# EasyEDA Pro project PS2toUSB.eprj

# Schematic Schematic1
Create Date: 2024-05-09; Page Name: P1; Project Name: PS2toUSB; Schematic Name: Schematic1; Update Date: 2024-05-14; Company: 嘉立创EDA; Page Size: A4; Version: V1.0
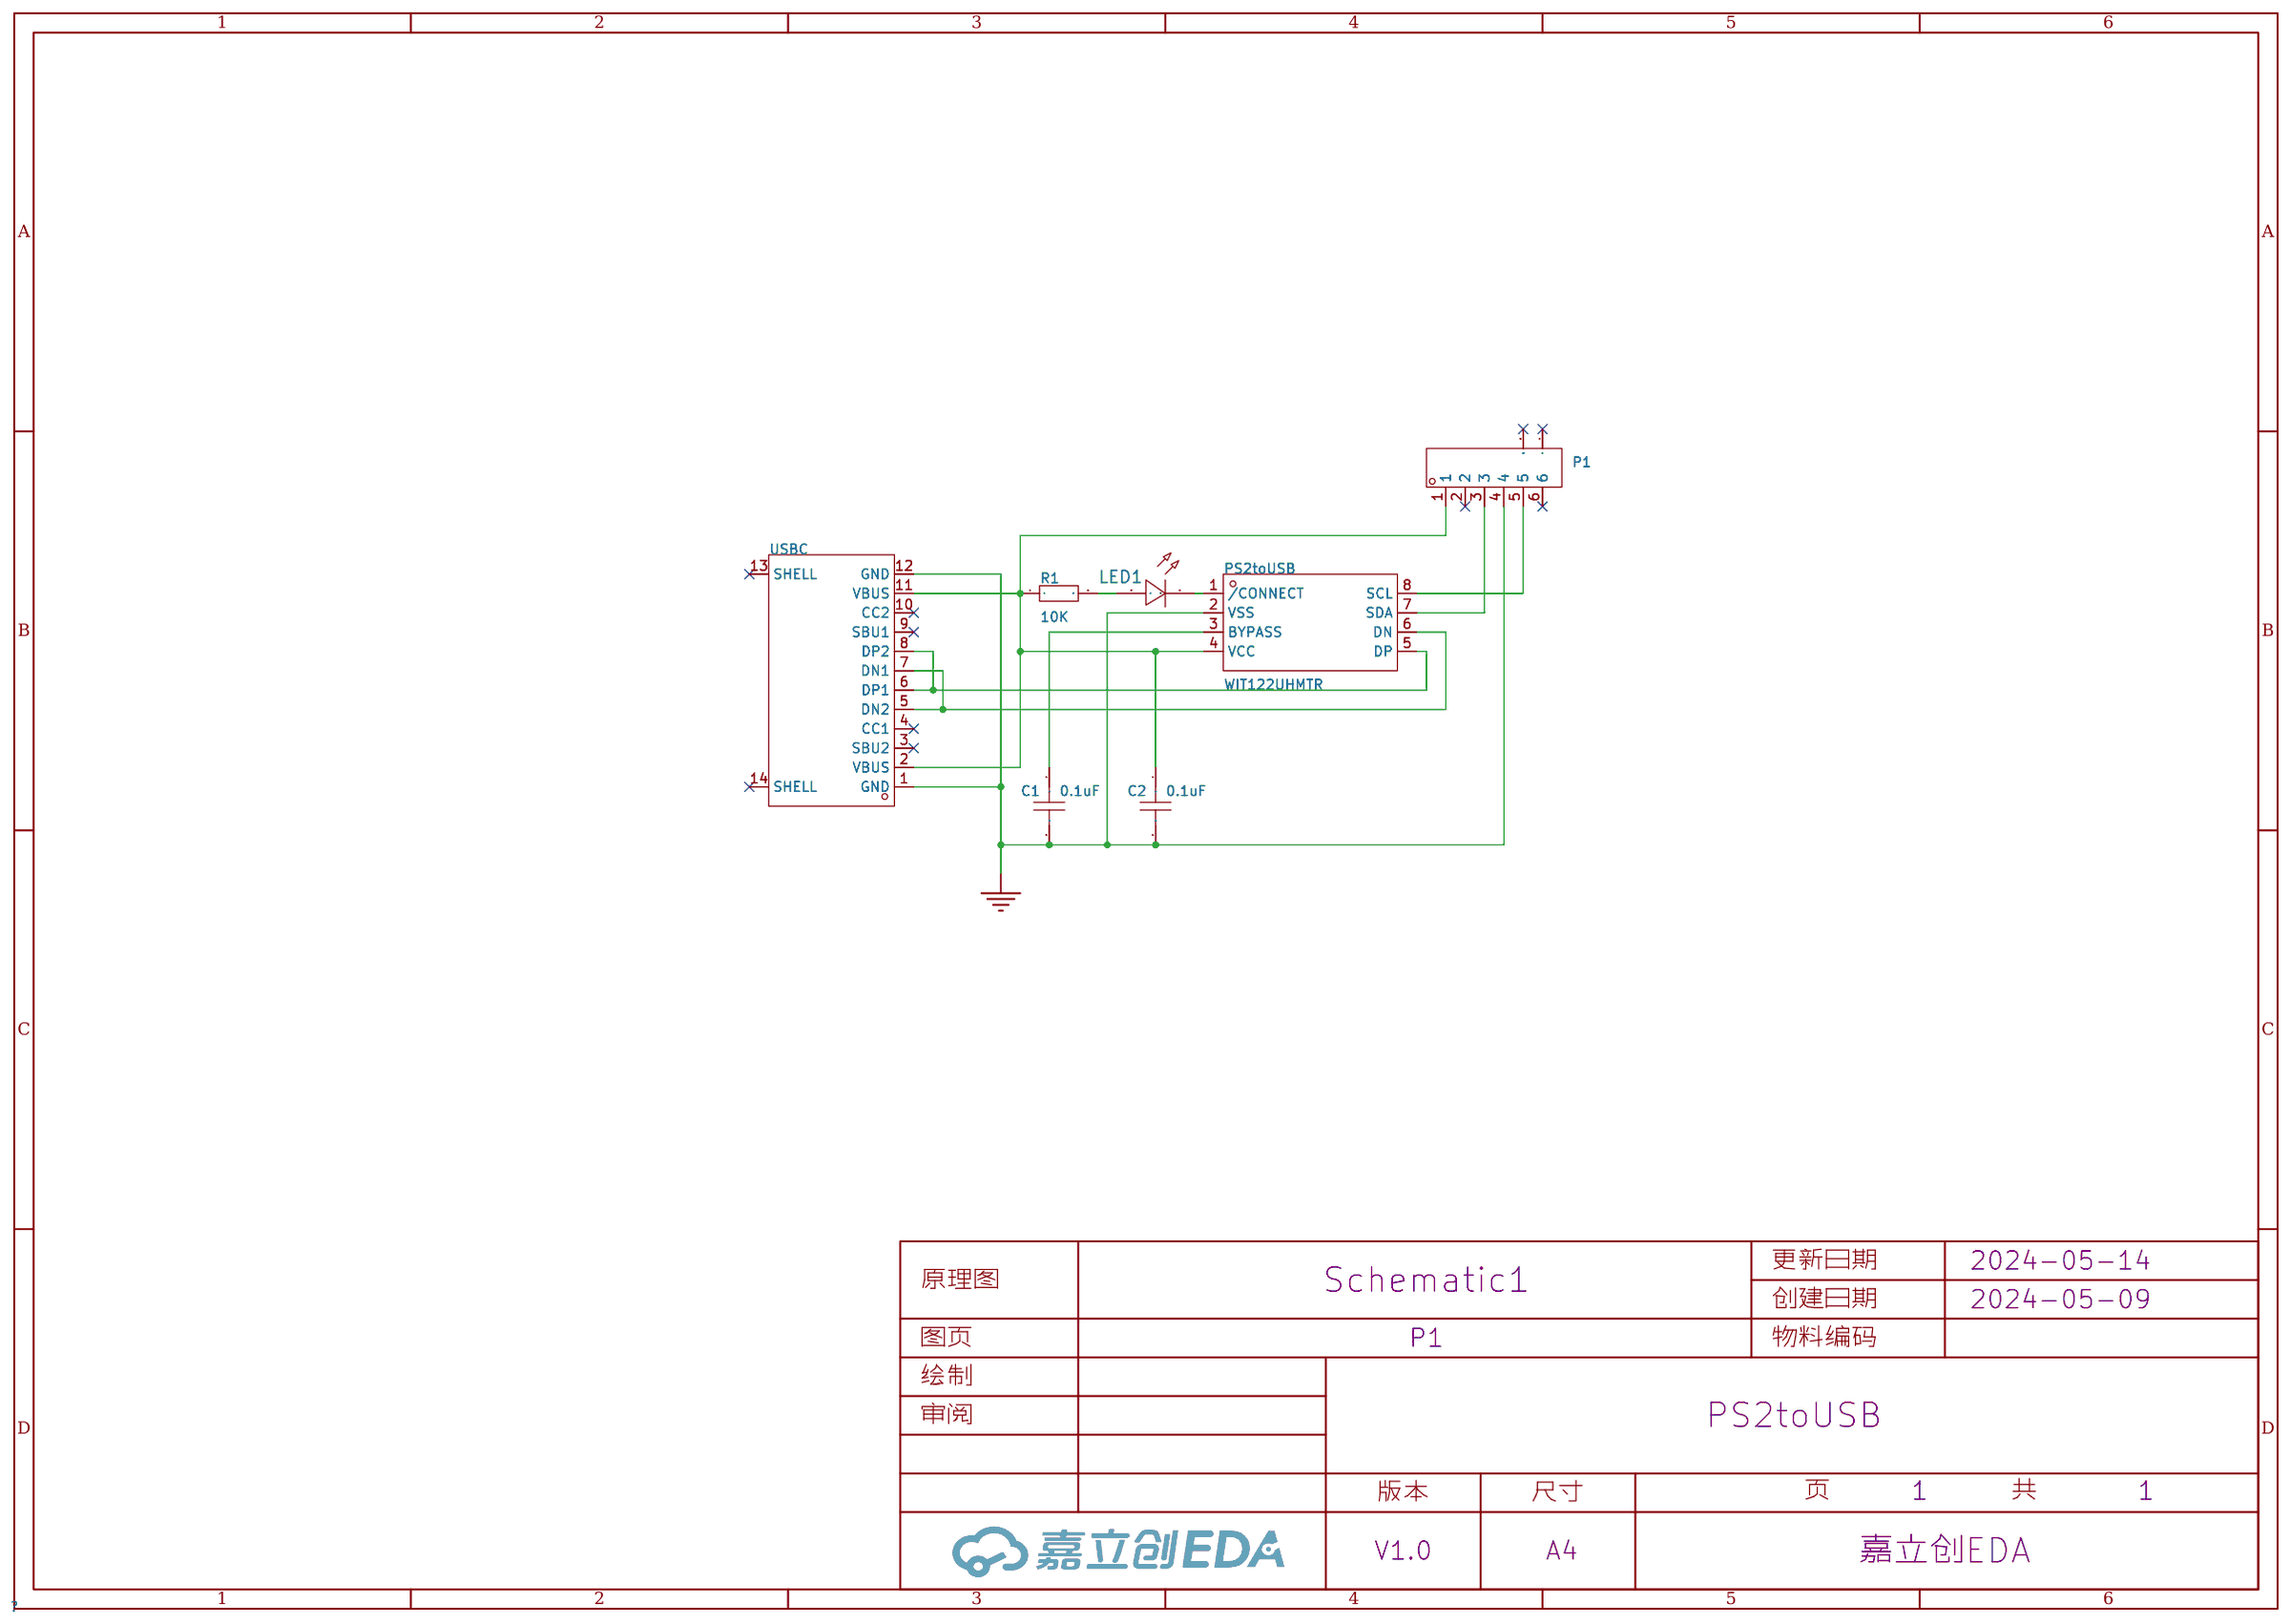
[diagram p0: schematic sheet]

## Parts
C1  0.1uF  [C0603]
C2  0.1uF  [C0603]
LED1  -  [LED_0603]
P1  VCC  [FPC-SMD_C47271]
PS2toUSB  WIT122UHMTR  [SOIC-8_L4.9-W3.9-P1.27-LS6.0-TR]
R1  10K  [R0603]
USBC  TYPE-C 16PIN 2MD(073)  [USB-C-SMD_TYPE-C-6PIN-2MD-073]

## Library data of the parts
C1 C2 = CAP_0603: Supplier Footprint: 0603
LED1 = LED_0603-R: Supplier Footprint: 0603
P1 = 1.0-6P上接: 锁定特性:抽屉式;触点类型:上接;触点数量:6P;间距:1mm;安装类型:卧贴;工作温度范围:-25℃~+85℃;; LCSC Part Name: 间距:1mm P数:6P 抽屉式 上接; Supplier Part: C47271; Manufacturer: BOOMELE(博穆精密); Supplier Footprint: SMD,P=1mm,卧贴; Datasheet: https://atta.szlcsc.com/upload/public/pdf/source/20231027/443F616BA0A67C4DA05E58DE2BCDE40A.pdf; Supplier: LCSC; Locking Feature: 抽屉式; Contact Type: 上接; Number of Contacts: 6P; Pitch: 1mm; Mounting Type: 卧贴; FFC, FCB Thickness: 0.3mm; Height Above Board: 2.8mm; Operating Temperature Range: -25℃~+85℃
PS2toUSB = WIT122UHMTR: Supplier Part: C9900004490; Supplier Footprint: SOIC-8; JLCPCB Part Class: 扩展库; Supplier: LCSC
R1 = Res_0603: Supplier Footprint: 0603
USBC = TYPE-C 16PIN 2MD(073): 连接器类型:Type-C;标准:-;公母:母;端口数量:1;触点数量:16P;安装方式:卧贴;额定电流 - 电源:5A;工作温度范围:-25℃~+85℃;; LCSC Part Name: Type-C 母 卧贴; Supplier Part: C2765186; Manufacturer: SHOU HAN(首韩); Supplier Footprint: SMD; Datasheet: https://atta.szlcsc.com/upload/public/pdf/source/20211123/39B17C16241EAC15C5E277BDA434118E.pdf; Supplier: LCSC; Connector Type: Type-C; Gender: 母; Number of Ports: 1; Number of Contacts: 16P; Mounting Style: 卧贴; Current Rating - Power (Max): 5A; Operating Temperature Range: -25℃~+85℃

## Nets
GND: C1.2 C2.2 P1.4 PS2toUSB.2(VSS) USBC.1(GND) USBC.12(GND)
$1N671: C1.1 PS2toUSB.3(BYPASS)
$1N785: LED1.2(A) R1.2
$1N812: LED1.1(C) PS2toUSB.1(/CONNECT)
Net-(C2-1): C2.1 P1.1 PS2toUSB.4(VCC) R1.1 USBC.2(VBUS) USBC.11(VBUS)
Net-(P1-3): P1.3 PS2toUSB.7(SDA)
Net-(P1-5): P1.5 PS2toUSB.8(SCL)
Net-(PS2toUSB-5): PS2toUSB.5(DP) USBC.6(DP1) USBC.8(DP2)
Net-(PS2toUSB-6): PS2toUSB.6(DN) USBC.5(DN2) USBC.7(DN1)

Not connected (* = marked no-connect by the designer): P1 2* 6* 7* 8*; USBC 3(SBU2)* 4(CC1)* 9(SBU1)* 10(CC2)* 13(SHELL)* 14(SHELL)*

# Board PCB1
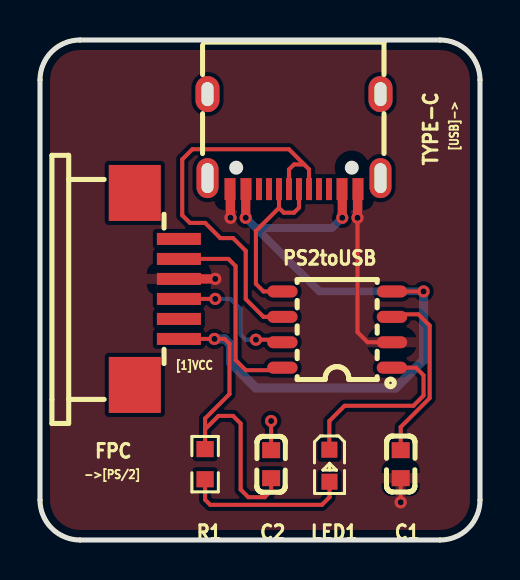
[diagram p1: board, top side]
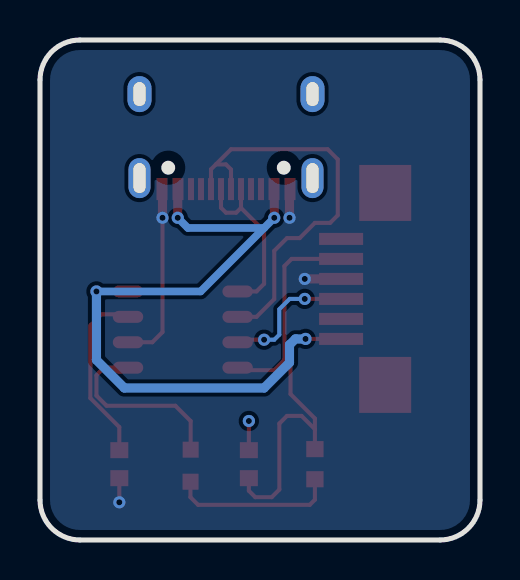
[diagram p2: board, bottom side, seen from below]

Outline 22 x 25 mm; copper layers: Top Layer, Bottom Layer. Coordinates in mm from the lower left corner of the outline.
Outline path: 0,23 0,2 arc(0.59,0.59) 2,0 20,0 arc(21.41,0.59) 22,2 22,23 arc(21.41,24.41) 20,25 2,25 arc(0.59,24.41) 0,23
Stack: Top Layer 0.035mm / Dielectric1 1.51mm FR4 er 4.5 / Bottom Layer 0.035mm

## Design rules (mm)
template: JLCPCB Capability(Two Layers Board)
spacing copperThickness1oz (default): track to track 0.102, other pairs 0.152 to 0.3
spacing copperThickness2oz: track to track 0.203, other pairs 0.152 to 0.3
track width copperThickness1oz (default): min 0.127, default 0.254, max 2.54
track width copperThickness2oz: min 0.203, default 0.254, max 2.54
differential pair differentialPair (default): width min 0.127, default 0.254, max 2.54; gap min 0.152, default 0.152
via viaSize (default): diameter min 0.5, default 0.61, max 10; hole min 0.3, default 0.305, max 6.3

## Placement (name value [footprint] x y rotation side)
C1  0.1uF  [C0603]  18.03 3.79 270 top
C2  0.1uF  [C0603]  11.56 3.79 90 top
FPC  VCC  [FPC-SMD_C47271]  5.84 12.55 270 top
LED1  -  [LED_0603]  14.48 3.66 270 top
PS2toUSB  WIT122UHMTR  [SOIC-8_L4.9-W3.9-P1.27-LS6.0-TR]  14.86 10.52 270 top
R1  10K  [R0603]  8.25 3.79 270 top
TYPE-C  TYPE-C 16PIN 2MD(073)  [USB-C-SMD_TYPE-C-6PIN-2MD-073]  12.7 19.92 180 top

## Footprints (pads in the part's own frame, mm; a bottom-side part is the same pattern mirrored in y, then rotated)
C0603
  rect 0.8x0.9 smd: 1(-0.7,0) 2(0.7,0)
FPC-SMD_C47271
  rect 0.6x2.2 smd: 1(2.5,1.103) 2(1.5,1.103) 3(0.5,1.103) 4(-0.5,1.103) 5(-1.5,1.103) 6(-2.5,1.103)
  rect 2.8x2.6 smd: 7(-4.8,-1.103) 8(4.8,-1.101)
LED_0603
  rect 0.8x0.8 smd: 1(-0.851,-0.01) 2(0.75,-0.005)
R0603
  rect 0.806x0.864 smd: 1(-0.753,0) 2(0.753,0)
SOIC-8_L4.9-W3.9-P1.27-LS6.0-TR
  oval 0.6x1.52 smd: 1(1.905,2.74) 2(0.635,2.74) 3(-0.635,2.74) 4(-1.905,2.74) 5(-1.905,-2.74) 6(-0.635,-2.74) 7(0.635,-2.74) 8(1.905,-2.74)
USB-C-SMD_TYPE-C-6PIN-2MD-073
  rect 0.55x1.1 smd: 1(-3.2,2.375) 2(-2.4,2.375) 11(2.4,2.375) 12(3.2,2.375)
  rect 0.3x1.1 smd: 3(-1.75,2.375) 4(-1.25,2.375) 5(-0.75,2.375) 6(-0.25,2.375) 7(0.25,2.375) 8(0.75,2.375) 9(1.25,2.375) 10(1.75,2.375)
  oval 1.1x2 hole 0.6x1.5: 13(-4.325,1.825) 14(4.325,1.825)
  oval 1.2x1.8 hole 0.6x1.2: 13(-4.325,-2.375) 14(4.325,-2.375)

## Nets
GND: C1.2 FPC.4 PS2toUSB.2 TYPE-C.1 TYPE-C.12
·: C2.2
$1N671: C1.1 PS2toUSB.3
$1N785: LED1.2 R1.2
$1N812: LED1.1 PS2toUSB.1
$1N840: PS2toUSB.6 TYPE-C.5 TYPE-C.7
$1N848: PS2toUSB.5 TYPE-C.6 TYPE-C.8
$1N1105: FPC.3 PS2toUSB.7
$1N1113: FPC.5 PS2toUSB.8
$1N1121: C2.1 FPC.1 PS2toUSB.4 R1.1 TYPE-C.2 TYPE-C.11

Pads without a net: FPC 2 6 7 8; TYPE-C 3 4 9 10 13 14

## Via types
v1: diameter 0.61, hole 0.305, Top Layer to Bottom Layer, 11 vias

## Routing (per net, layer and track width the routed paths; a pad name or vN(x,y) marks a point on that pad's centre or on a via; arc(x,y) is an arc through that point)
GND: length 15
  Top Layer w0.203: v1(15.88,16.11) 15.88,10.39 16.38,9.89 PS2toUSB.2 ; C1.2 v1(18.03,1.89) ; 11.56,4.49 v1(11.56,5.95)
  Top Layer w0.457: v1(9.53,16.11) 9.53,17.52 TYPE-C.12 ; v1(15.88,16.11) 15.88,17.52 TYPE-C.1 ; FPC.4 v1(8.76,13.05)
$1N671: length 9
  Top Layer w0.203: 17.6,11.16 17.73,11.28 18.92,11.28 19.48,10.72 19.48,7.09 18.03,5.65 C1.1
$1N785: length 8.3
  Top Layer w0.203: LED1.2 14.48,2.91 14.48,2.14 14.1,1.76 8.51,1.76 8.25,2.01 R1.2
$1N812: length 9.4
  Top Layer w0.203: LED1.1 14.47,5.95 15.23,6.71 18.67,6.71 19.18,7.22 19.18,8.24 18.8,8.62 PS2toUSB.1
$1N840: length 21.1
  Top Layer w0.203: 13.21,18.78 13.45,18.53 TYPE-C.5 ; 13.21,18.78 12.45,19.54 7.62,19.54 7.11,19.03 7.11,16.24 7.49,15.86 8.25,15.86 9.02,15.09 9.65,15.09 10.29,14.46 10.29,12.05 11.18,11.16 12.12,11.16 ; 13.21,18.78 12.7,18.78 12.45,18.53 TYPE-C.7
$1N848: length 8.8
  Top Layer w0.203: 11.95,16.61 12.19,16.36 12.7,16.36 12.95,16.61 TYPE-C.6 ; 11.95,16.61 10.79,15.45 10.79,12.81 11.18,12.43 PS2toUSB.5 ; 11.95,16.61 TYPE-C.8
$1N1105: length 6.8
  Top Layer w0.203: v1(10.79,10.01) 11.99,10.01 PS2toUSB.7 ; FPC.3 v1(8.76,12.05)
  Bottom Layer w0.203: v1(10.79,10.01) 10.29,10.01 10.03,10.27 10.03,11.54 9.52,12.05 v1(8.76,12.05)
$1N1113: length 10.3
  Top Layer w0.203: PS2toUSB.8 11.99,8.49 10.29,8.49 9.78,9 9.78,13.7 9.42,14.05 FPC.5
$1N1121: length 51.8
  Top Layer w0.203: C2.1 11.56,2.46 11.24,2.14 10.41,2.14 10.03,2.52 10.03,5.82 9.65,6.2 8.92,6.2 8.25,5.54 ; R1.1 8.25,5.54 ; 8.25,5.54 8.25,6.08 9.47,7.3 9.47,9.81 9.23,10.05 v1(8.72,10.05) FPC.1 ; PS2toUSB.4 v1(19.18,12.43)
  Top Layer w0.457: v1(10.29,16.11) 10.29,17.53 TYPE-C.11 ; v1(15.11,16.11) 15.11,17.53 TYPE-C.2
  Bottom Layer w0.381: v1(19.18,12.43) 13.97,12.43 10.79,15.6 ; v1(10.29,16.11) 10.79,15.6 ; 10.79,15.6 14.6,15.6 v1(15.11,16.11)
  Bottom Layer w0.457: v1(19.18,12.43) 19.18,9 17.78,7.6 10.79,7.6 9.53,8.87 9.53,9.76 9.23,10.05 v1(8.72,10.05)

## Copper pours and planes (outline as drawn; the poured copper is in the pictures)
GND on Top Layer: -8.25,28.3 32.13,28.3 32.13,-8.02 -8.25,-8.02
GND on Bottom Layer: -4.19,26.02 25.4,26.02 25.4,-1.54 -4.19,-1.54

## Text on the board
Top Silkscreen Layer: ->[PS/2] | [1]VCC | [USB]->
